# Altium schematic sheet AnalogSupplies.SchDoc
size 420 x 297 mm; SheetNumber: 1; SheetTotal: 4
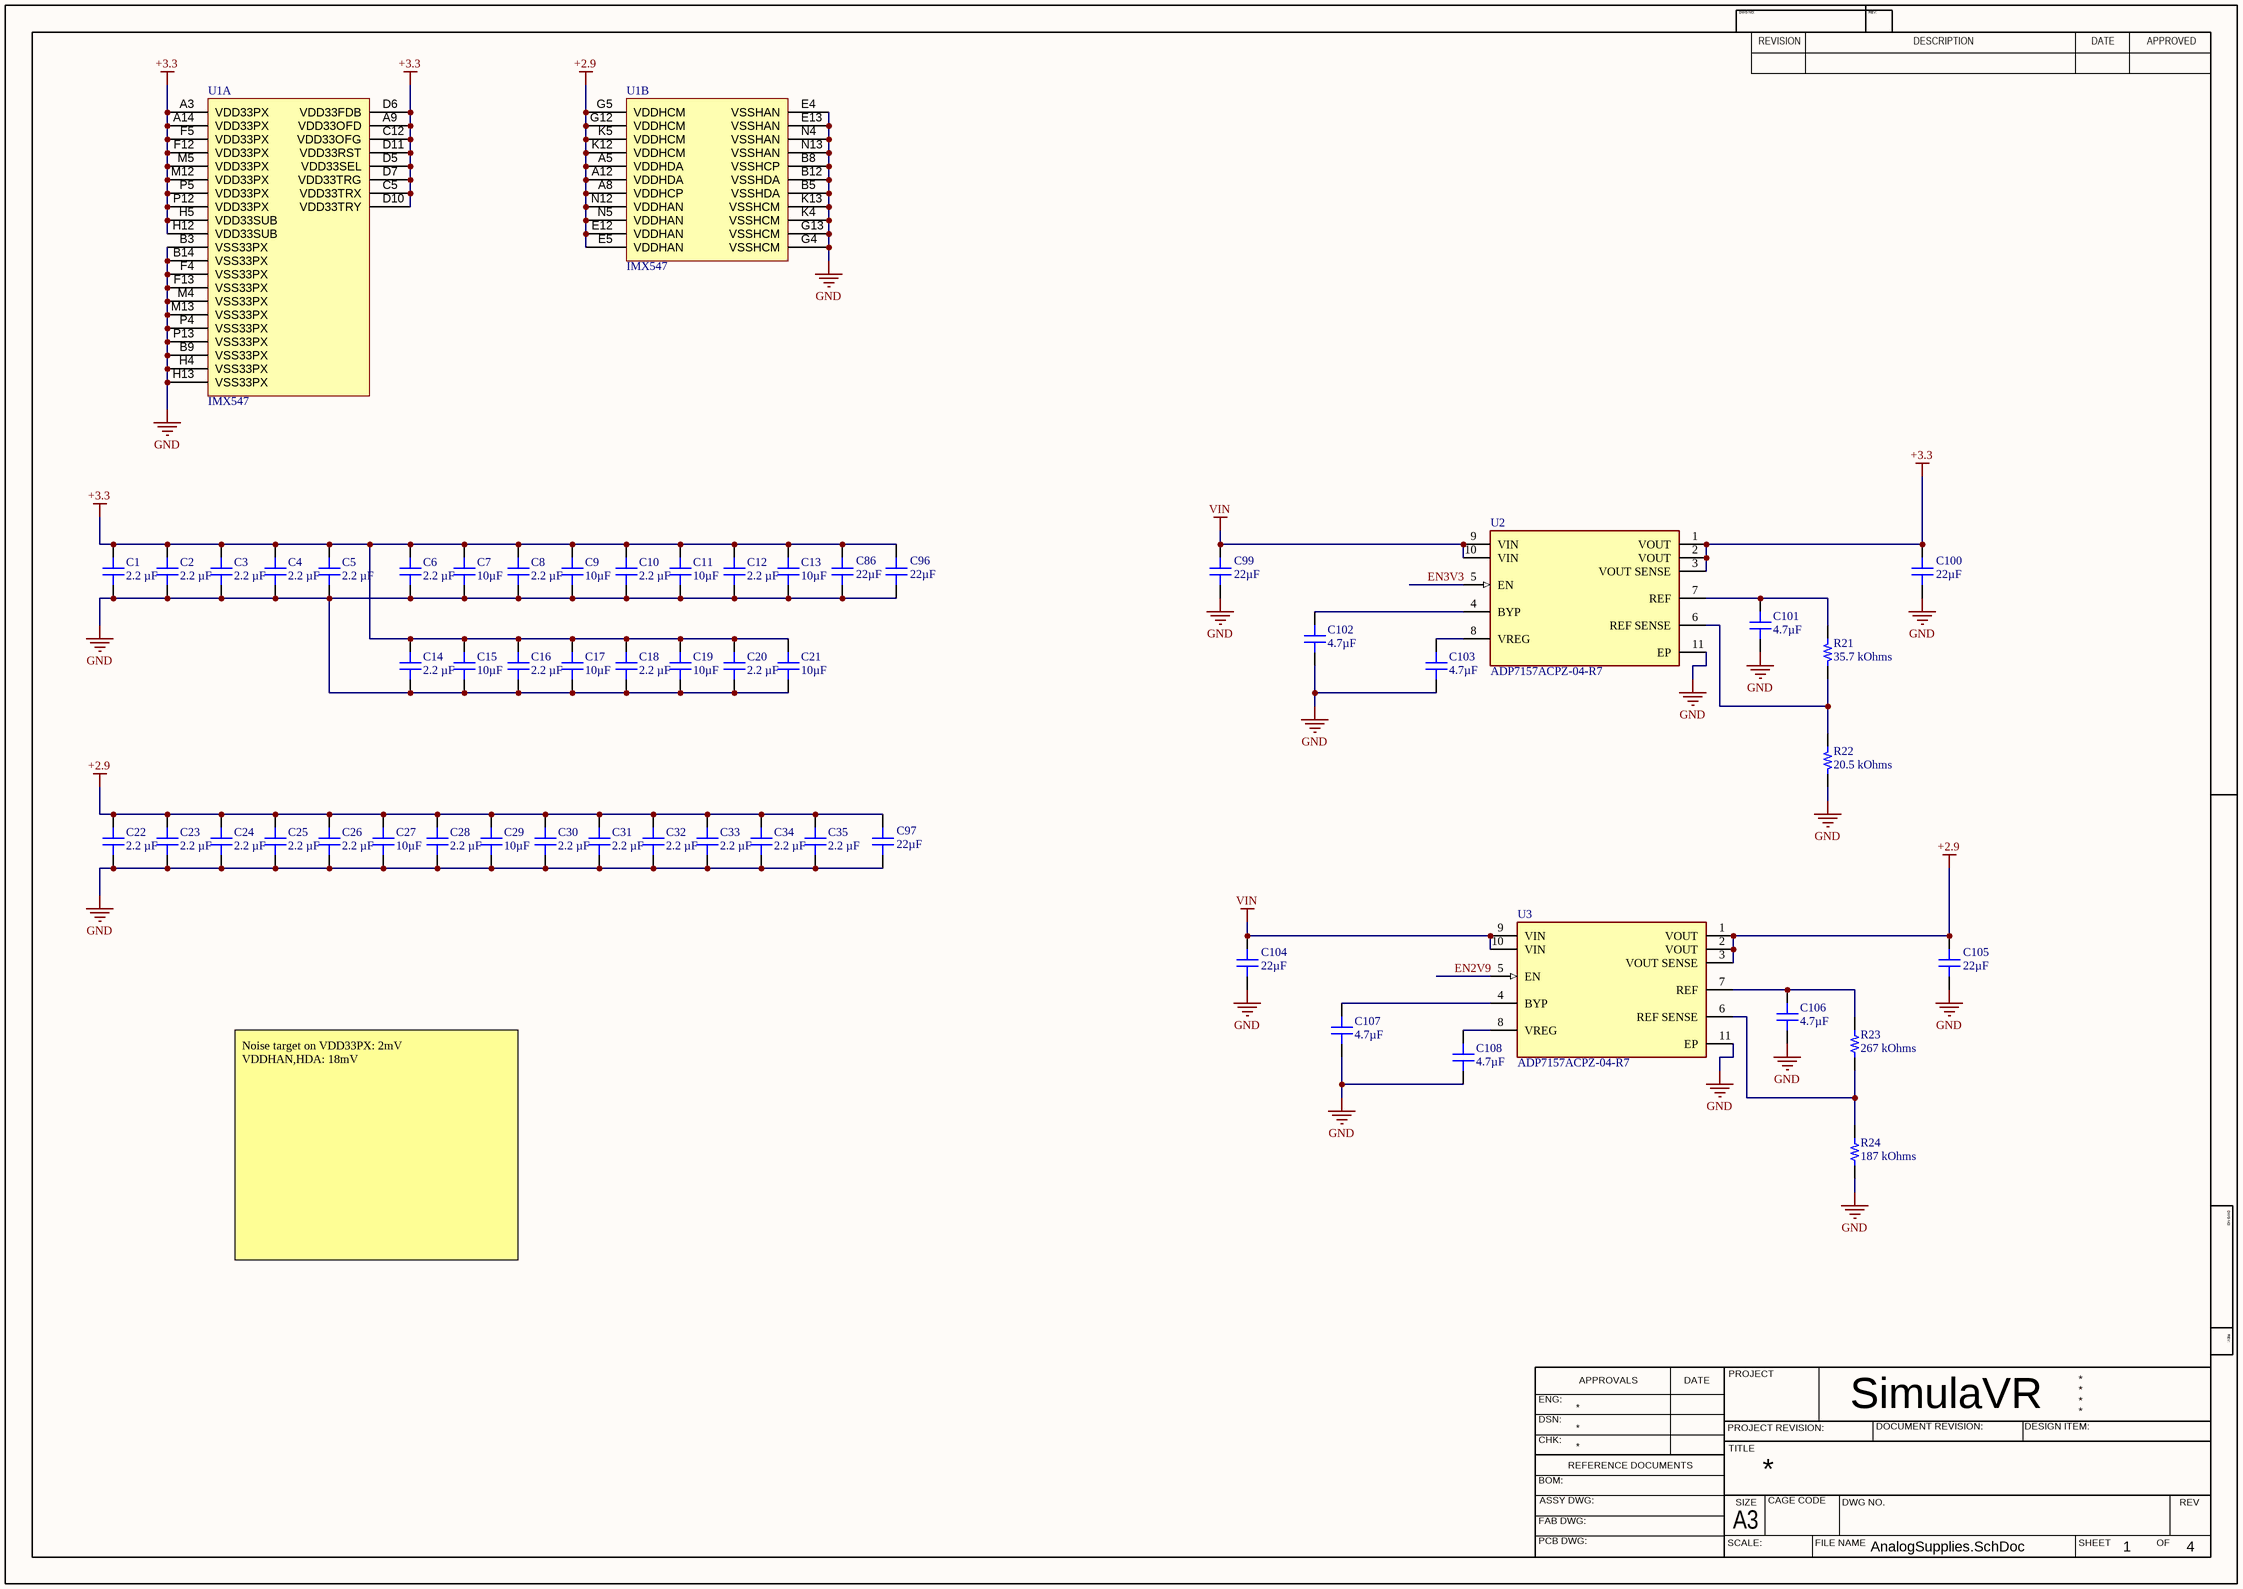
[diagram p0: AnalogSupplies.SchDoc]

## Parts
C1  2.2 µF  [FP-GRM033-0_09-MFG]
C2  2.2 µF  [FP-GRM033-0_09-MFG]
C3  2.2 µF  [FP-GRM033-0_09-MFG]
C4  2.2 µF  [FP-GRM033-0_09-MFG]
C5  2.2 µF  [FP-GRM033-0_09-MFG]
C6  2.2 µF  [FP-GRM033-0_09-MFG]
C7  10µF  [FP-GRM188-0_15-MFG]
C8  2.2 µF  [FP-GRM033-0_09-MFG]
C9  10µF  [FP-GRM188-0_15-MFG]
C10  2.2 µF  [FP-GRM033-0_09-MFG]
C11  10µF  [FP-GRM188-0_15-MFG]
C12  2.2 µF  [FP-GRM033-0_09-MFG]
C13  10µF  [FP-GRM188-0_15-MFG]
C14  2.2 µF  [FP-GRM033-0_09-MFG]
C15  10µF  [FP-GRM188-0_15-MFG]
C16  2.2 µF  [FP-GRM033-0_09-MFG]
C17  10µF  [FP-GRM188-0_15-MFG]
C18  2.2 µF  [FP-GRM033-0_09-MFG]
C19  10µF  [FP-GRM188-0_15-MFG]
C20  2.2 µF  [FP-GRM033-0_09-MFG]
C21  10µF  [FP-GRM188-0_15-MFG]
C22  2.2 µF  [FP-GRM033-0_09-MFG]
C23  2.2 µF  [FP-GRM033-0_09-MFG]
C24  2.2 µF  [FP-GRM033-0_09-MFG]
C25  2.2 µF  [FP-GRM033-0_09-MFG]
C26  2.2 µF  [FP-GRM033-0_09-MFG]
C27  10µF  [FP-GRM188-0_15-MFG]
C28  2.2 µF  [FP-GRM033-0_09-MFG]
C29  10µF  [FP-GRM188-0_15-MFG]
C30  2.2 µF  [FP-GRM033-0_09-MFG]
C31  2.2 µF  [FP-GRM033-0_09-MFG]
C32  2.2 µF  [FP-GRM033-0_09-MFG]
C33  2.2 µF  [FP-GRM033-0_09-MFG]
C34  2.2 µF  [FP-GRM033-0_09-MFG]
C35  2.2 µF  [FP-GRM033-0_09-MFG]
C86  22µF  [FP-GRM21B-0_2-e0_2_0_7-MFG]
C96  22µF  [FP-GRM21B-0_2-e0_2_0_7-MFG]
C97  22µF  [FP-GRM21B-0_2-e0_2_0_7-MFG]
C99  22µF  [FP-GRM21B-0_2-e0_2_0_7-MFG]
C100  22µF  [FP-GRM21B-0_2-e0_2_0_7-MFG]
C101  4.7µF  [FP-GRM155-0_15-MFG]
C102  4.7µF  [FP-GRM155-0_15-MFG]
C103  4.7µF  [FP-GRM155-0_15-MFG]
C104  22µF  [FP-GRM21B-0_2-e0_2_0_7-MFG]
C105  22µF  [FP-GRM21B-0_2-e0_2_0_7-MFG]
C106  4.7µF  [FP-GRM155-0_15-MFG]
C107  4.7µF  [FP-GRM155-0_15-MFG]
C108  4.7µF  [FP-GRM155-0_15-MFG]
R21  35.7 kOhms  [RES 0201_0603]
R22  20.5 kOhms  [RES 0201_0603]
R23  267 kOhms  [RES 0201_0603]
R24  187 kOhms  [RES 0201_0603]
U1  IMX547  [LGA230C100P16X17_1680X2000X260]  (parts A,B of 11)
U2  ADP7157ACPZ-04-R7  [FP-CP-10-9-IPC_B]
U3  ADP7157ACPZ-04-R7  [FP-CP-10-9-IPC_B]

## Nets
+2.9: C22.2 C23.2 C24.2 C25.2 C26.2 C27.2 C28.2 C29.2 C30.2 C31.2 C32.2 C33.2 C34.2 C35.2 C97.1 C105.1 U1.A5(VDDHDA) U1.A8(VDDHCP) U1.A12(VDDHDA) U1.E5(VDDHAN) U1.E12(VDDHAN) U1.G5(VDDHCM) U1.G12(VDDHCM) U1.K5(VDDHCM) U1.K12(VDDHCM) U1.N5(VDDHAN) U1.N12(VDDHAN) U3.1(VOUT) U3.2(VOUT) U3.3(VOUT_SENSE)
+3.3: C1.2 C2.2 C3.2 C4.2 C5.2 C6.2 C7.2 C8.2 C9.2 C10.2 C11.2 C12.2 C13.2 C14.2 C15.2 C16.2 C17.2 C18.2 C19.2 C20.2 C21.2 C86.1 C96.1 C100.1 U1.A3(VDD33PX) U1.A9(VDD33OFD) U1.A14(VDD33PX) U1.C5(VDD33TRX) U1.C12(VDD33OFG) U1.D5(VDD33SEL) U1.D6(VDD33FDB) U1.D7(VDD33TRG) U1.D10(VDD33TRY) U1.D11(VDD33RST) U1.F5(VDD33PX) U1.F12(VDD33PX) U1.H5(VDD33SUB) U1.H12(VDD33SUB) U1.M5(VDD33PX) U1.M12(VDD33PX) U1.P5(VDD33PX) U1.P12(VDD33PX) U2.1(VOUT) U2.2(VOUT) U2.3(VOUT_SENSE)
GND: C1.1 C2.1 C3.1 C4.1 C5.1 C6.1 C7.1 C8.1 C9.1 C10.1 C11.1 C12.1 C13.1 C14.1 C15.1 C16.1 C17.1 C18.1 C19.1 C20.1 C21.1 C22.1 C23.1 C24.1 C25.1 C26.1 C27.1 C28.1 C29.1 C30.1 C31.1 C32.1 C33.1 C34.1 C35.1 C86.2 C96.2 C97.2 C99.2 C100.2 C101.1 C102.1 C103.1 C104.2 C105.2 C106.1 C107.1 C108.1 R22.1 R24.1 U1.B3(VSS33PX) U1.B5(VSSHDA) U1.B8(VSSHCP) U1.B9(VSS33PX) U1.B12(VSSHDA) U1.B14(VSS33PX) U1.E4(VSSHAN) U1.E13(VSSHAN) U1.F4(VSS33PX) U1.F13(VSS33PX) U1.G4(VSSHCM) U1.G13(VSSHCM) U1.H4(VSS33PX) U1.H13(VSS33PX) U1.K4(VSSHCM) U1.K13(VSSHCM) U1.M4(VSS33PX) U1.M13(VSS33PX) U1.N4(VSSHAN) U1.N13(VSSHAN) U1.P4(VSS33PX) U1.P13(VSS33PX) U2.11(EP) U3.11(EP)
VIN: C99.1 C104.1 U2.9(VIN) U2.10(VIN) U3.9(VIN) U3.10(VIN)
EN2V9: U3.5(EN)
EN3V3: U2.5(EN)
NetC101_2: C101.2 R21.2 U2.7(REF)
NetC102_2: C102.2 U2.4(BYP)
NetC103_2: C103.2 U2.8(VREG)
NetC106_2: C106.2 R23.2 U3.7(REF)
NetC107_2: C107.2 U3.4(BYP)
NetC108_2: C108.2 U3.8(VREG)
NetR21_1: R21.1 R22.2 U2.6(REF_SENSE)
NetR23_1: R23.1 R24.2 U3.6(REF_SENSE)

## Notes on the sheet
- Noise target on VDD33PX: 2mV
  VDDHAN,HDA: 18mV
- DWG NO:
- REVISION
- REV:
- DESCRIPTION
- DATE
- APPROVED
- ENG:
- APPROVALS
- PROJECT
- DSN:
- CHK:
- REFERENCE DOCUMENTS
- PROJECT REVISION:
- TITLE
- SimulaVR
- DOCUMENT REVISION:
- DESIGN ITEM:
- BOM:
- FAB DWG:
- PCB DWG:
- ASSY DWG:
- SCALE:
- A3
- SIZE
- CAGE CODE
- FILE NAME
- DWG NO.
- SHEET
- OF
- REV

## Library data of the parts
C1-C6 C8 C10 C12 C14 C16 C18 C20 C22-C26 C28 C30-C35 = GRM033R60J225ME01D: CAP CER 2.2UF 6.3V X5R 0201; manufacturer: Murata Electronics; Tolerance: ±20%; Part Number: GRM033R60J225ME01D; Value: 2.2 µF; Applications: General Purpose; Capacitance: 2.2 µF; componentlink1description: Datasheet; componentlink1url: https://search.murata.co.jp/Ceramy/image/img/A01X/G101/ENG/GRM033R60J225ME01-01A.pdf; componentlink2description: DigiKey Link; componentlink2url: https://www.digikey.com/en/products/detail/murata-electronics/GRM033R60J225ME01D/16033628; Device Package: 0201 (0603 Metric); lastupdated: 19.09.2022 12:54:17; Lifecycle Status: Active; Minimum Order: 1; Mounting Type: Surface Mount, MLCC; Operating Temperature: -55°C ~ 85°C; Package / Case: 0201 (0603 Metric); packaging: TapeAndReel; partid: 41005; Part Status: Active; price: 0.02; series: GRM; Size / Dimension: 0.024" L x 0.012" W (0.60mm x 0.30mm); Supplier 1: DigiKey; Supplier Part Number 1: 490-GRM033R60J225ME01DCT-ND; Temperature Coefficient: X5R; Thickness (Max): 0.015" (0.39mm); Voltage - Rated: 6.3V
C7 C9 C11 C13 C15 C17 C19 C21 C27 C29 = GRM188R61A106MAALD: CAP CER 10UF 10V X5R 0603; Manufacturer: Murata Electronics; Tolerance: ±20%; Part Number: GRM188R61A106MAALD; Value: 10µF; Applications: General Purpose; Capacitance: 10µF; ComponentLink1Description: Datasheet; ComponentLink1URL: https://search.murata.co.jp/Ceramy/image/img/A01X/G101/ENG/GRM188R61A106MAAL-01.pdf; ComponentLink2Description: DigiKey Link; ComponentLink2URL: http://digikey.com/product-detail/en/murata-electronics/GRM188R61A106MAALD/490-12734-1-ND/5797703; Device Package: 0603 (1608 Metric); LastUpdated: 9/2/2020 1:03:35 AM; Lifecycle Status: Active; Minimum Order: 1; Mounting Type: Surface Mount, MLCC; Operating Temperature: -55°C ~ 85°C; Package / Case: 0603 (1608 Metric); Packaging: TapeAndReel; PartId: 2423; Part Status: Active; Price: 0.08; Series: GRM; Size / Dimension: 0.063" L x 0.031" W (1.60mm x 0.80mm); Supplier 1: DigiKey; Supplier Part Number 1: 490-12734-1-ND; Temperature Coefficient: X5R; Thickness (Max): 0.037" (0.95mm); Voltage - Rated: 10V
C86 C96 C97 C99 C100 C104 C105 = GRM21BR61A226ME44L: CAP CER 22UF 10V X5R 0805; Manufacturer: Murata Electronics; Tolerance: ±20%; Part Number: GRM21BR61A226ME44L; Value: 22µF; Capacitance: 22µF; ComponentLink1Description: Datasheet; ComponentLink1URL: https://search.murata.co.jp/Ceramy/image/img/A01X/G101/ENG/GRM21BR61A226ME44-01.pdf; ComponentLink2Description: DigiKey Link; ComponentLink2URL: http://digikey.com/product-detail/en/murata-electronics/GRM21BR61A226ME44L/490-10746-1-ND/5251354; Device Package: 0805 (2012 Metric); LastUpdated: 9/2/2020 1:04:36 AM; Lifecycle Status: Active; Minimum Order: 1; Mounting Type: Surface Mount, MLCC; Operating Temperature: -55°C ~ 85°C; Package / Case: 0805 (2012 Metric); Packaging: TapeAndReel; PartId: 6027; Part Status: Active; Price: 0.12; Series: GRM; Size / Dimension: 0.079" L x 0.049" W (2.00mm x 1.25mm); Supplier 1: DigiKey; Supplier Part Number 1: 490-10746-1-ND; Voltage - Rated: 10V; Applications: General Purpose; Temperature Coefficient: X5R; Thickness (Max): 0.057" (1.45mm)
C101-C103 C106-C108 = GRM155R61A475MEAAD: CAP CER 4.7UF 10V X5R 0402; Manufacturer: Murata Electronics; Tolerance: ±20%; Part Number: GRM155R61A475MEAAD; Value: 4.7µF; Applications: General Purpose; Capacitance: 4.7µF; ComponentLink1Description: Datasheet; ComponentLink1URL: https://search.murata.co.jp/Ceramy/image/img/A01X/G101/ENG/GRM155R61A475MEAA-01.pdf; ComponentLink2Description: DigiKey Link; ComponentLink2URL: https://www.digikey.com/en/products/detail/murata-electronics/GRM155R61A475MEAAD/6234735; Device Package: 0402 (1005 Metric); LastUpdated: 2/8/2022 12:26:50 PM; Lifecycle Status: Active; Minimum Order: 1; Mounting Type: Surface Mount, MLCC; Operating Temperature: -55°C ~ 85°C; Package / Case: 0402 (1005 Metric); Packaging: TapeAndReel; PartId: 6746; Part Status: Active; Price: 0.03; Series: GRM; Size / Dimension: 0.039" L x 0.020" W (1.00mm x 0.50mm); Supplier 1: DigiKey; Supplier Part Number 1: 490-14306-1-ND; Temperature Coefficient: X5R; Thickness (Max): 0.026" (0.65mm); Voltage - Rated: 10V
R21 = ERJ-1GNF3572C: RES SMD 35.7K OHM 1% 1/20W 0201; Manufacturer: Panasonic Electronic Components; Power (Watts): 0.05W, 1/20W; Temperature Coefficient: ±200ppm/°C; Part Number: ERJ-1GNF3572C; Value: 35.7 kOhms; ComponentLink1Description: Datasheet; ComponentLink1URL: https://industrial.panasonic.com/cdbs/www-data/pdf/RDA0000/AOA0000C304.pdf; ComponentLink2Description: DigiKey Link; ComponentLink2URL: https://www.digikey.com/en/products/detail/panasonic-electronic-components/ERJ-1GNF3572C/2036287; Composition: Thick Film; Device Package: 0201 (0603 Metric); Features: Automotive AEC-Q200; Height - Seated (Max): 0.010" (0.26mm); LastUpdated: 5/20/2022 2:48:18 PM; Lifecycle Status: Active; Minimum Order: 1; Number of Terminations: 2; Operating Temperature: -55°C ~ 125°C; Package / Case: 0201 (0603 Metric); Packaging: TapeAndReel; PartId: 448; Part Status: Active; Price: 0.01; Ratings: AEC-Q200; Resistance: 35.7 kOhms; Series: ERJ-1GN; Size / Dimension: 0.024" L x 0.012" W (0.60mm x 0.30mm); Supplier 1: DigiKey; Supplier Part Number 1: P122958CT-ND; Supplier Device Package: 0201; Tolerance: ±1%
R22 = ERJ-1GNF2052C: RES SMD 20.5K OHM 1% 1/20W 0201; Manufacturer: Panasonic Electronic Components; Power (Watts): 0.05W, 1/20W; Temperature Coefficient: ±200ppm/°C; Part Number: ERJ-1GNF2052C; Value: 20.5 kOhms; ComponentLink1Description: Datasheet; ComponentLink1URL: https://industrial.panasonic.com/cdbs/www-data/pdf/RDA0000/AOA0000C304.pdf; ComponentLink2Description: DigiKey Link; ComponentLink2URL: http://digikey.com/product-detail/en/panasonic-electronic-components/ERJ-1GNF2052C/P122817CT-ND/8342573; Composition: Thick Film; Device Package: 0201 (0603 Metric); Features: Automotive AEC-Q200; Height - Seated (Max): 0.010" (0.26mm); LastUpdated: 5/20/2022 2:47:55 PM; Lifecycle Status: Active; Minimum Order: 1; Number of Terminations: 2; Operating Temperature: -55°C ~ 125°C; Package / Case: 0201 (0603 Metric); Packaging: TapeAndReel; PartId: 4106; Part Status: Active; Price: 0.01; Ratings: AEC-Q200; Resistance: 20.5 kOhms; Series: ERJ; Size / Dimension: 0.024" L x 0.012" W (0.60mm x 0.30mm); Supplier 1: DigiKey; Supplier Part Number 1: P122817CT-ND; Supplier Device Package: 0201; Tolerance: ±1%
R23 = RC0201FR-07267KL: RES 267K OHM 1% 1/20W 0201; Manufacturer: Yageo; Power (Watts): 0.05W, 1/20W; Temperature Coefficient: ±200ppm/°C; Part Number: RC0201FR-07267KL; Value: 267 kOhms; ComponentLink1Description: Datasheet; ComponentLink1URL: https://www.yageo.com/upload/media/product/productsearch/datasheet/rchip/PYu-RC_Group_51_RoHS_L_10.pdf; ComponentLink2Description: DigiKey Link; ComponentLink2URL: https://www.digikey.com/en/products/detail/yageo/RC0201FR-07267KL/5280402; Composition: Thick Film; Device Package: 0201 (0603 Metric); Features: Moisture Resistant; Height - Seated (Max): 0.010" (0.26mm); LastUpdated: 5/20/2022 2:48:07 PM; Lifecycle Status: Active; Minimum Order: 1; Number of Terminations: 2; Operating Temperature: -55°C ~ 125°C; Package / Case: 0201 (0603 Metric); Packaging: CutTape; PartId: 1831; Part Status: Active; Price: 0.01; Resistance: 267 kOhms; Series: RC_L; Size / Dimension: 0.024" L x 0.012" W (0.60mm x 0.30mm); Supplier 1: DigiKey; Supplier Part Number 1: YAG2542CT-ND; Supplier Device Package: 0201; Tolerance: ±1%
R24 = ERJ-1GNF1873C: RES SMD 187K OHM 1% 1/20W 0201; Manufacturer: Panasonic Electronic Components; Power (Watts): 0.05W, 1/20W; Temperature Coefficient: ±200ppm/°C; Part Number: ERJ-1GNF1873C; Value: 187 kOhms; ComponentLink1Description: Datasheet; ComponentLink1URL: https://industrial.panasonic.com/cdbs/www-data/pdf/RDA0000/AOA0000C304.pdf; ComponentLink2Description: DigiKey Link; ComponentLink2URL: https://www.digikey.com/en/products/detail/panasonic-electronic-components/ERJ-1GNF1873C/2036369; Composition: Thick Film; Device Package: 0201 (0603 Metric); Features: Automotive AEC-Q200; Height - Seated (Max): 0.010" (0.26mm); LastUpdated: 5/20/2022 2:48:21 PM; Lifecycle Status: Active; Minimum Order: 1; Number of Terminations: 2; Operating Temperature: -55°C ~ 125°C; Package / Case: 0201 (0603 Metric); Packaging: TapeAndReel; PartId: 70; Part Status: Active; Price: 0.01; Ratings: AEC-Q200; Resistance: 187 kOhms; Series: ERJ-1GN; Size / Dimension: 0.024" L x 0.012" W (0.60mm x 0.30mm); Supplier 1: DigiKey; Supplier Part Number 1: P122798CT-ND; Supplier Device Package: 0201; Tolerance: ±1%
U1 = CMP-001-0000-4: Sony IMX547 sensor
U2 U3 = CMP-019-00054-1: LDO Regulator Pos 1.2V to 3.3V 1.2A 10-Pin LFCSP EP T/R